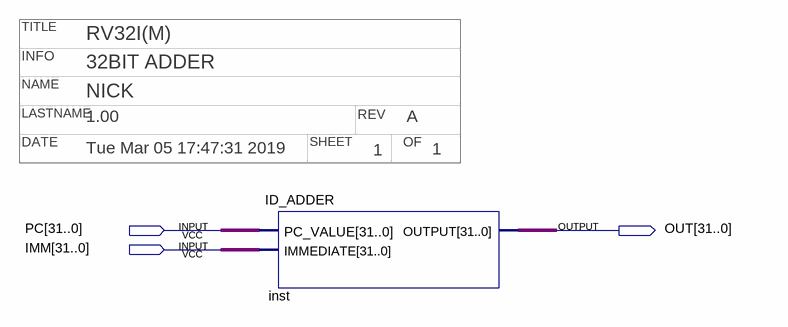
[diagram p0: schematic sheet]
// Quartus schematic ID_ADDERTEST.bdf as structural Verilog: 1 symbols, 3 pins
// Title block: TITLE: RV32I(M); INFO: 32BIT ADDER; NAME: NICK; LASTNAME: 1.00; REV: A; DATE: Tue Mar 05 17:47:31 2019; SHEET: 1; OF: 1
module ID_ADDERTEST (
  input  [31:0] PC,
  input  [31:0] IMM,
  output [31:0] OUT
);

  ID_ADDER inst (.PC_VALUE(PC), .IMMEDIATE(IMM), .OUTPUT(OUT));
endmodule
